# Altium schematic sheet Signal_Multiplexers.SchDoc
size C
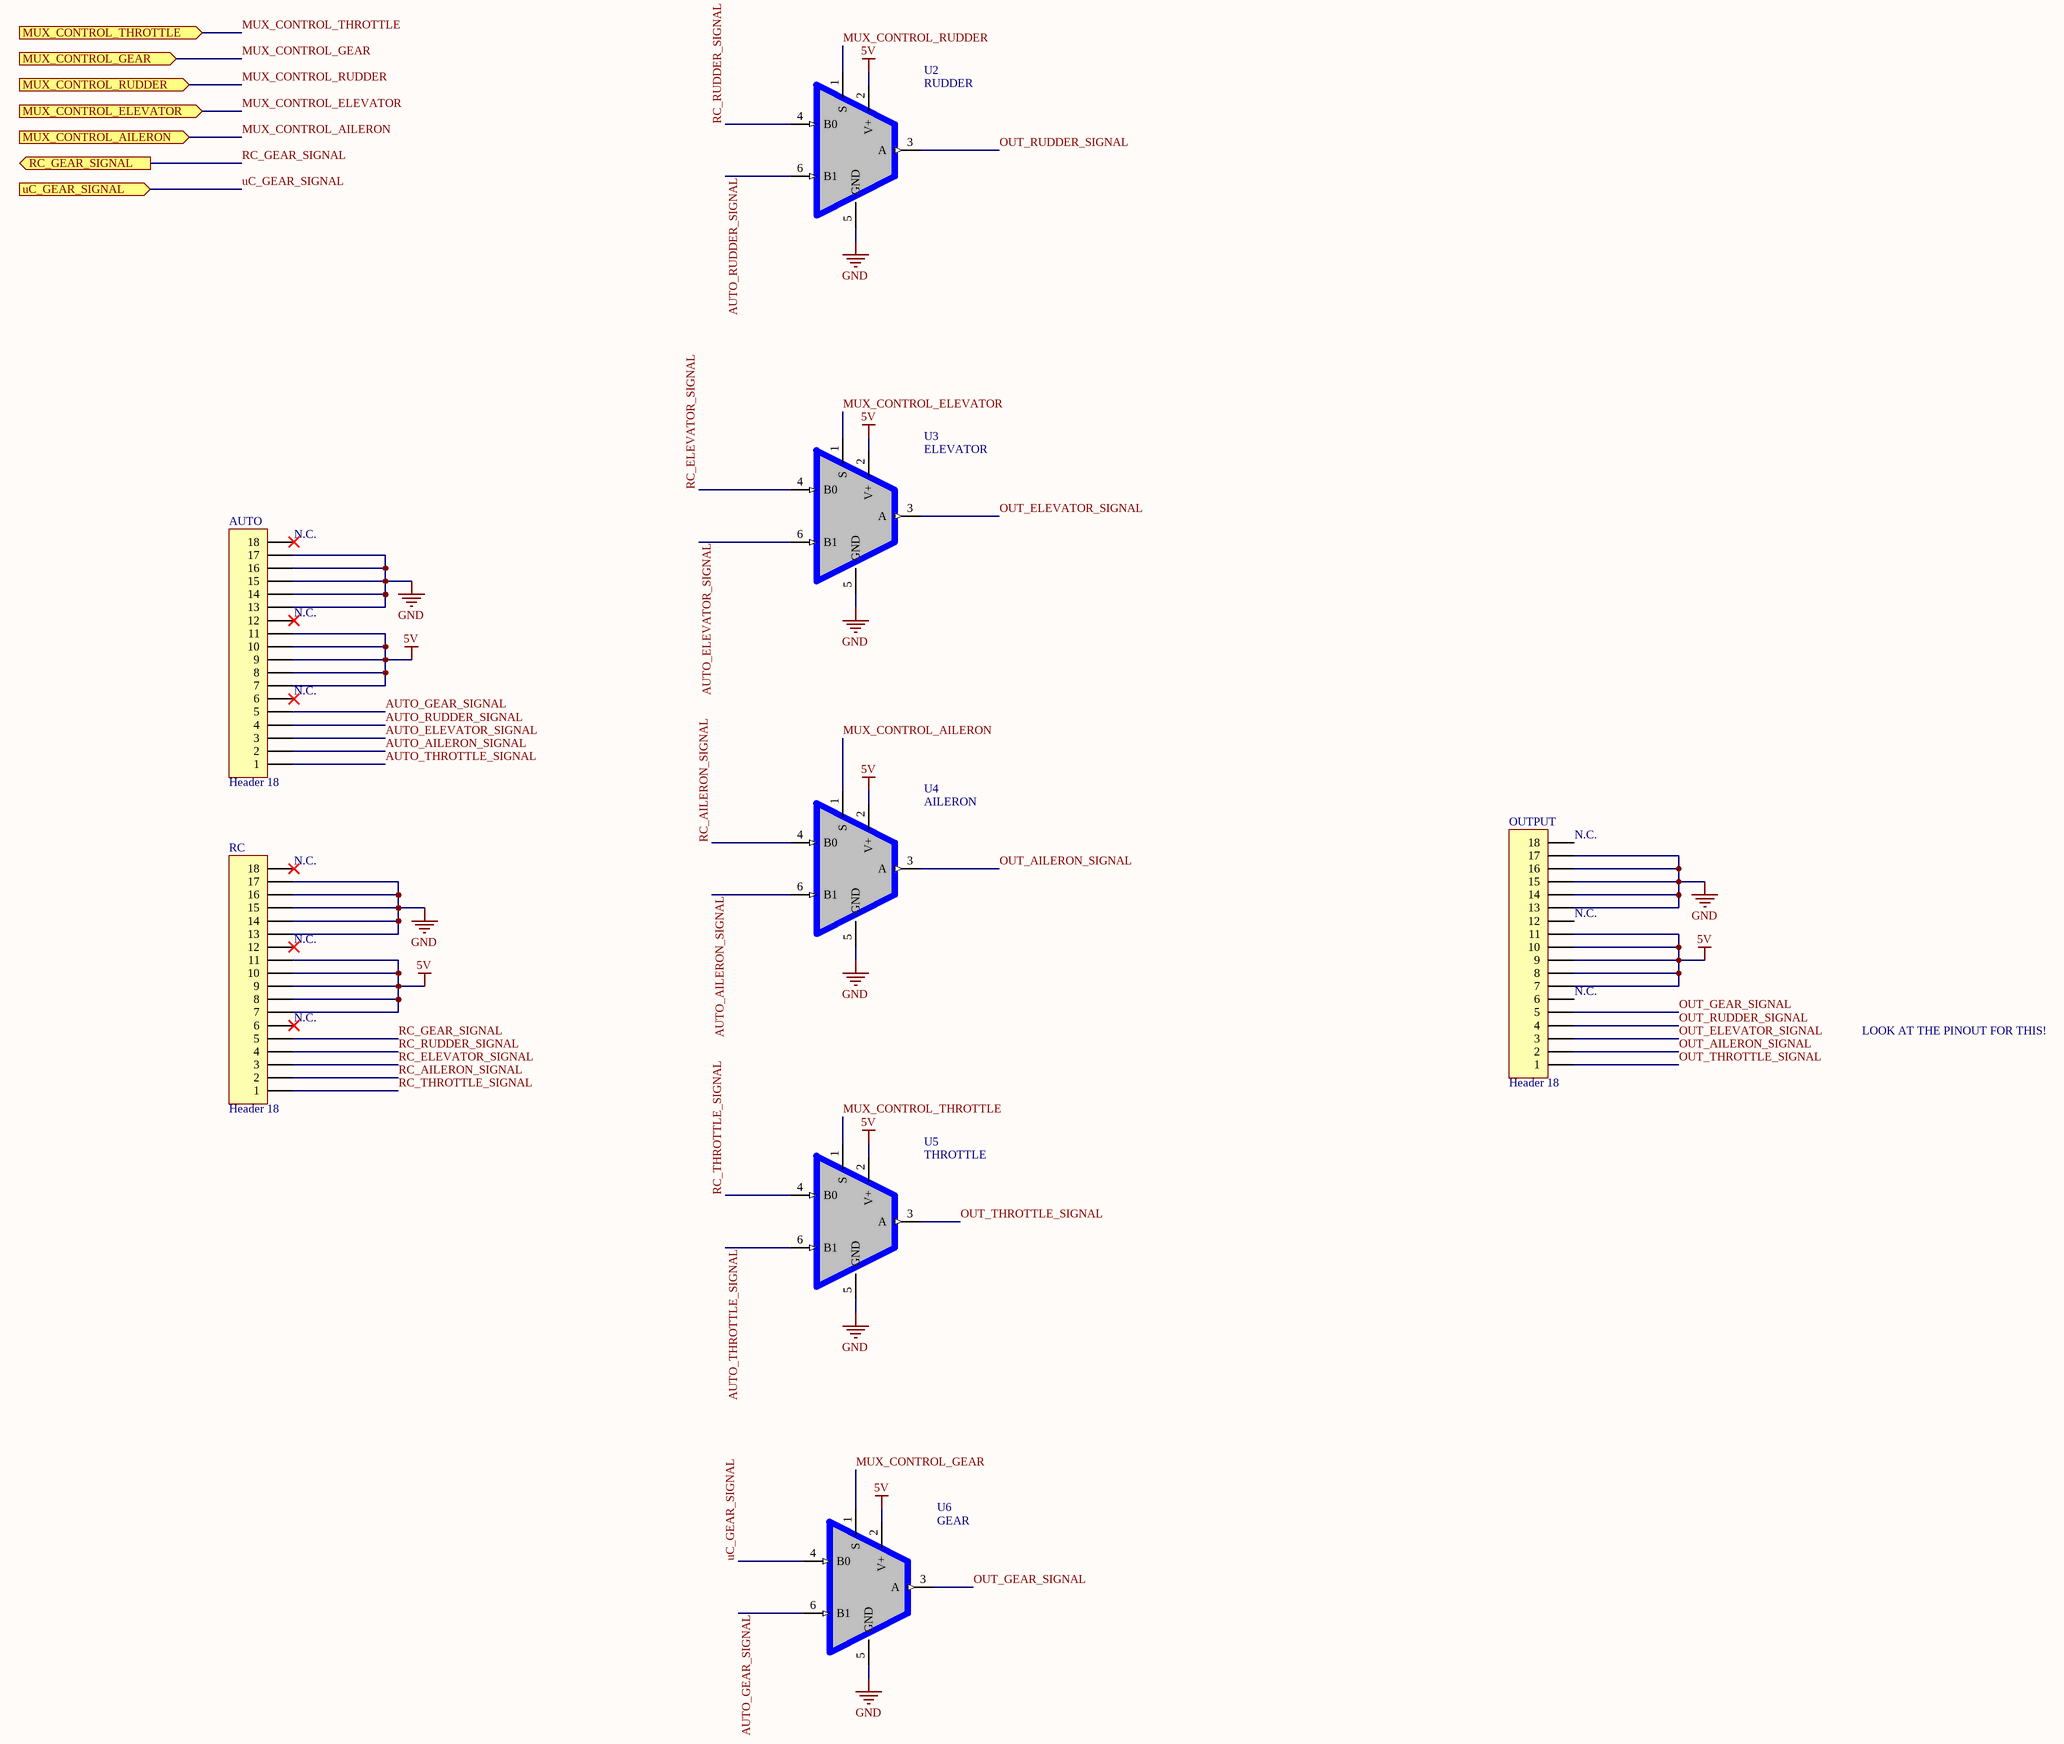
[diagram p0: Signal_Multiplexers.SchDoc]

## Parts
AUTO  Header 18  [PCBComponent_1]
OUTPUT  Header 18  [PCBComponent_1]
RC  Header 18  [PCBComponent_1]
U2  RUDDER  [uDFN-6L]
U3  ELEVATOR  [uDFN-6L]
U4  AILERON  [uDFN-6L]
U5  THROTTLE  [uDFN-6L]
U6  GEAR  [uDFN-6L]

## Ports
MUX_CONTROL_AILERON (in), MUX_CONTROL_ELEVATOR (in), MUX_CONTROL_GEAR (in), MUX_CONTROL_RUDDER (in), MUX_CONTROL_THROTTLE (in), RC_GEAR_SIGNAL (out), uC_GEAR_SIGNAL (in)

## Nets
5V: AUTO.7 AUTO.8 AUTO.9 AUTO.10 AUTO.11 OUTPUT.7 OUTPUT.8 OUTPUT.9 OUTPUT.10 OUTPUT.11 RC.7 RC.8 RC.9 RC.10 RC.11 U2.2(V+) U3.2(V+) U4.2(V+) U5.2(V+) U6.2(V+)
GND: AUTO.13 AUTO.14 AUTO.15 AUTO.16 AUTO.17 OUTPUT.13 OUTPUT.14 OUTPUT.15 OUTPUT.16 OUTPUT.17 RC.13 RC.14 RC.15 RC.16 RC.17 U2.5(GND) U3.5(GND) U4.5(GND) U5.5(GND) U6.5(GND)
AUTO_AILERON_SIGNAL: AUTO.2 U4.6(B1)
AUTO_ELEVATOR_SIGNAL: AUTO.3 U3.6(B1)
AUTO_GEAR_SIGNAL: AUTO.5 U6.6(B1)
AUTO_RUDDER_SIGNAL: AUTO.4 U2.6(B1)
AUTO_THROTTLE_SIGNAL: AUTO.1 U5.6(B1)
MUX_CONTROL_AILERON: U4.1(S) ; port MUX_CONTROL_AILERON
MUX_CONTROL_ELEVATOR: U3.1(S) ; port MUX_CONTROL_ELEVATOR
MUX_CONTROL_GEAR: U6.1(S) ; port MUX_CONTROL_GEAR
MUX_CONTROL_RUDDER: U2.1(S) ; port MUX_CONTROL_RUDDER
MUX_CONTROL_THROTTLE: U5.1(S) ; port MUX_CONTROL_THROTTLE
OUT_AILERON_SIGNAL: OUTPUT.2 U4.3(A)
OUT_ELEVATOR_SIGNAL: OUTPUT.3 U3.3(A)
OUT_GEAR_SIGNAL: OUTPUT.5 U6.3(A)
OUT_RUDDER_SIGNAL: OUTPUT.4 U2.3(A)
OUT_THROTTLE_SIGNAL: OUTPUT.1 U5.3(A)
RC_AILERON_SIGNAL: RC.2 U4.4(B0)
RC_ELEVATOR_SIGNAL: RC.3 U3.4(B0)
RC_GEAR_SIGNAL: RC.5 ; port RC_GEAR_SIGNAL
RC_RUDDER_SIGNAL: RC.4 U2.4(B0)
RC_THROTTLE_SIGNAL: RC.1 U5.4(B0)
uC_GEAR_SIGNAL: U6.4(B0) ; port uC_GEAR_SIGNAL

Not connected (* = marked no-connect by the designer): AUTO 6* 12* 18*; OUTPUT 6 12 18; RC 6* 12* 18*

## Notes on the sheet
- (near AUTO) N.C.
- (near RC) N.C.
- (near OUTPUT) N.C.
- LOOK AT THE PINOUT FOR THIS!
- Title
- Size:
- Date:
- File:
- C
- Number:
- Time:
- Revision:
- Sheet
- of

## Library data of the parts
AUTO OUTPUT RC = Header 18: Header, 18-Pin; Manufacturer: Preci-Dip; Manufacturer Part Number: 894-80-030-20-001101; Pitch: 0.1inch; LatestRevisionDate: 17-Jul-2002; LatestRevisionNote: Re-released for DXP Platform.; Publisher: Altium Limited; Supplier 1: Mouser; Supplier Part Number 1: 437-8948003020001101; Contact Plating: Tin; Number of Rows: 3; Mount: Through Hole; Row Spacing: 0.1inch; ComponentLink1URL: https://datasheet.ciiva.com/18657/catalog-18657350.pdf; ComponentLink1Description: https://datasheet.ciiva.com/18657/catalog-18657350.pdf
U2-U6 = DG4157EDN: Multiplexer Switch ICs SPDT 2:1 Mutiplxr 1.65-5.5V; 0.7ohm; Supplier 2: Digi-Key; ComponentLink1Description: Datasheet; ComponentLink1URL: https://www.mouser.com/datasheet/2/427/dg4157e-1291751.pdf; ComponentLink2Description: Foorptint; ComponentLink2URL: http://www.vishay.com/docs/76086/udfn-6l.pdf; Supplier 1: Mouser; Supplier Part Number 2: DG4157EDN-T1-GE4TR-ND; Supplier Part Number 1: 78-DG4157EDN-T1-GE4